# Altium project 24E_Ergo.PrjPcb
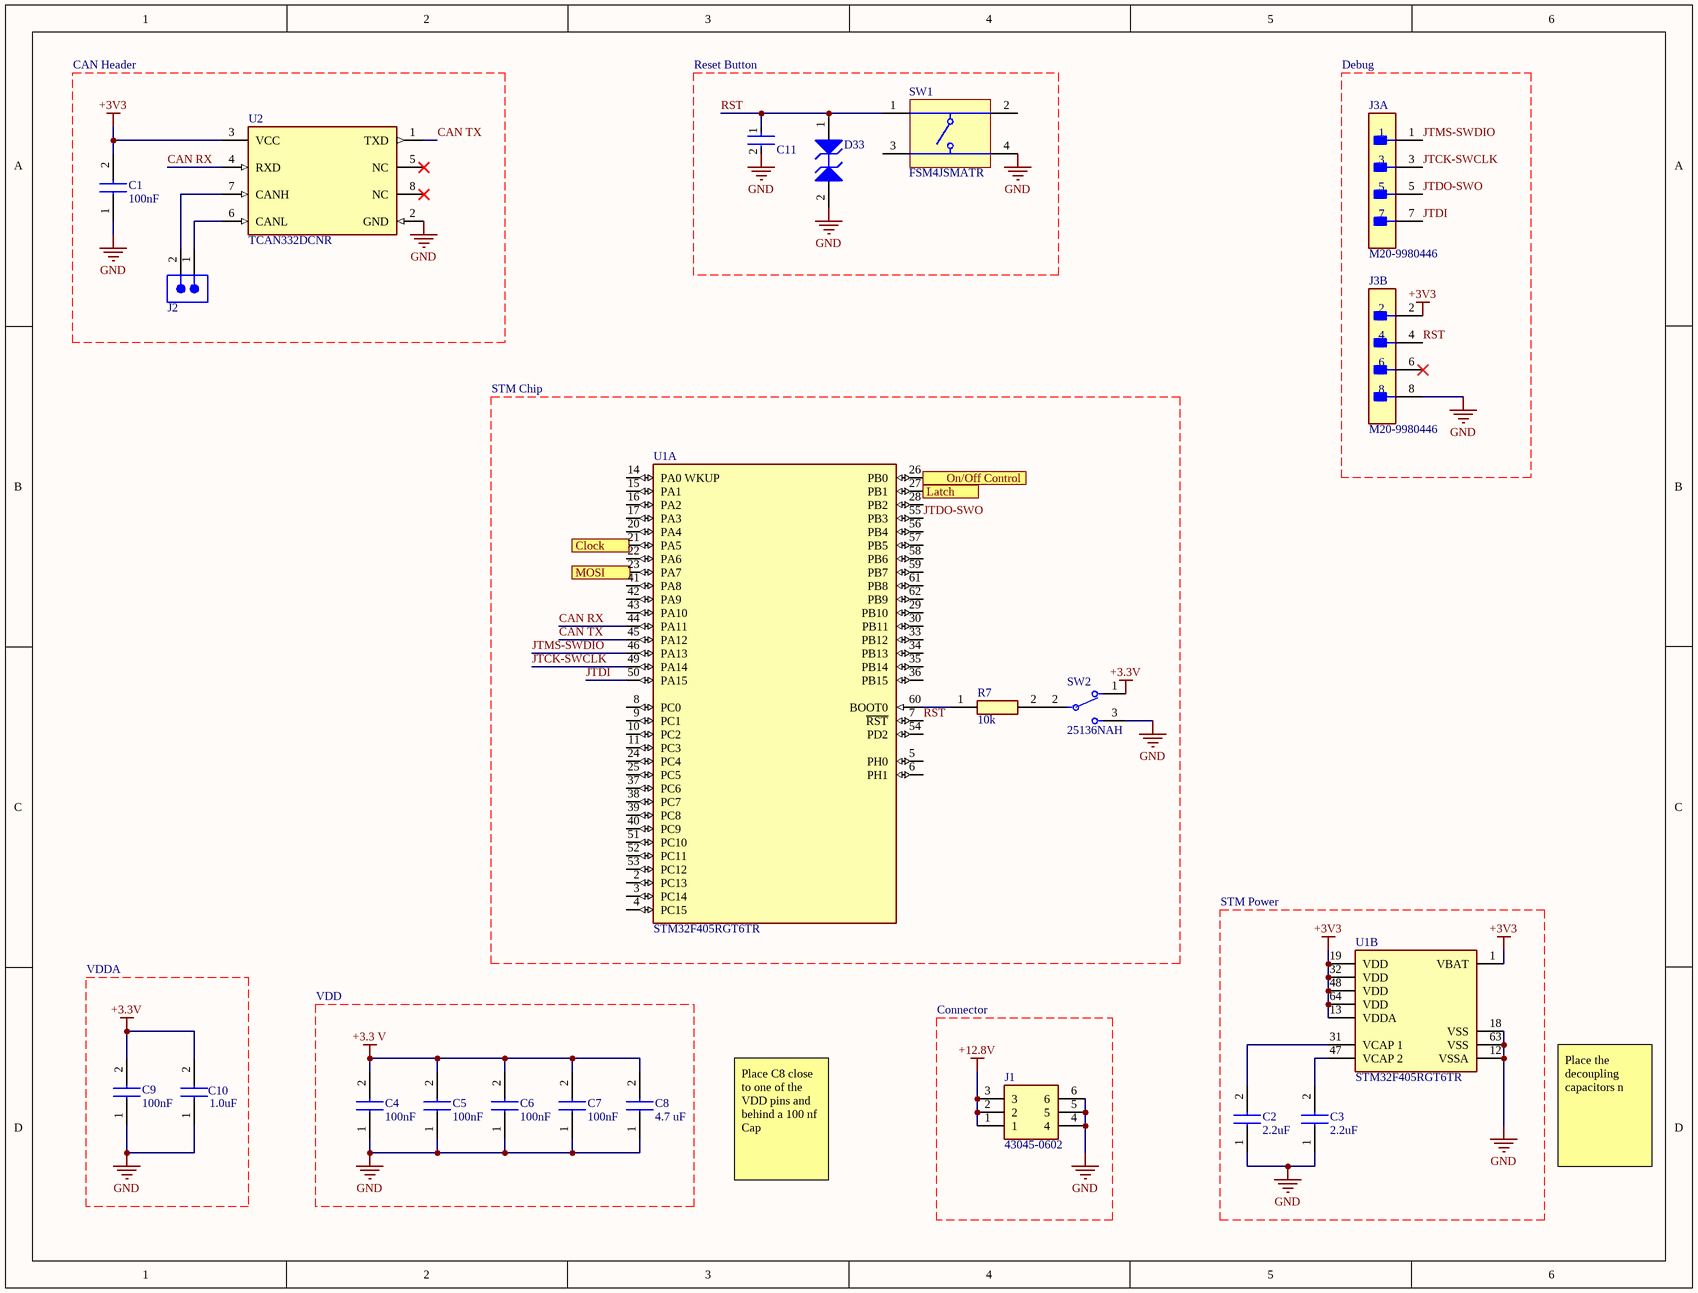
[diagram p0: STM32F405.SchDoc]
3 sheets, 70 parts. Net scope: flat (ports and power ports of the same name join across sheets).
Board file: 24E_Ergo.PcbDoc
Sheets:
  STM32F405.SchDoc
  Power_Tree.SchDoc
  LED_Array.SchDoc

## Sheet STM32F405.SchDoc
size 317 x 241 mm

### Parts
C1  100nF  [C1206]
C2  2.2uF  [CAPC2012X145N]
C3  2.2uF  [CAPC2012X145N]
C4  100nF  [C1206]
C5  100nF  [C1206]
C6  100nF  [C1206]
C7  100nF  [C1206]
C8  4.7 uF  [C1210]
C9  100nF  [CAPC3216X95N]
C10  1.0uF  [C0805]
C11  100 nF  [FP-CL31-IPC_C]  (value not drawn)
D33  ESD5B5.0ST1G  [ONSC-SOD-523-2-502-01_C_V]  (value not drawn)
J1  43045-0602  [43045-06(00,01,02,10)]
J2  679302124022  [679302124022]  (value not drawn)
J3  M20-9980446  [FP-M20-9980446-MFG]  (parts A,B of 2)
R7  10k  [RESC3016X65N]
SW1  FSM4JSMATR  [TECO-FSM4JSMATR_V]
SW2  25136NAH  [FP-25136NAH-MFG]
U1  STM32F405RGT6TR  [FP-LQFP64-5W-IPC_C]  (parts A,B of 2)
U2  TCAN332DCNR  [FP-DCN0008A-IPC_A]

### Ports
Clock (out), Latch (out), MOSI (out), On/Off Control (out)

### Nets
+3.3 V: C4.2 C5.2 C6.2 C7.2 C8.2
+3.3V: C9.2 C10.2 SW2.1
+3V3: C1.2 J3.2 U1.1(VBAT) U1.13(VDDA) U1.19(VDD) U1.32(VDD) U1.48(VDD) U1.64(VDD) U2.3(VCC)
+12.8V: J1.1 J1.2 J1.3
GND: C1.1 C2.1 C3.1 C4.1 C5.1 C6.1 C7.1 C8.1 C9.1 C10.1 C11.2 D33.2(A2) J1.4 J1.5 J1.6 J3.8 SW1.4 SW2.3 U1.12(VSSA) U1.18(VSS) U1.63(VSS) U2.2(GND)
CAN RX: U1.44(PA11) U2.4(RXD)
CAN TX: U1.45(PA12) U2.1(TXD)
JTCK-SWCLK: J3.3 U1.49(PA14)
JTDI: J3.7 U1.50(PA15)
JTDO-SWO: J3.5 U1.55(PB3)
JTMS-SWDIO: J3.1 U1.46(PA13)
RST: C11.1 D33.1(A1) J3.4 SW1.1 U1.7(~{RST})
NetC2_2: C2.2 U1.31(VCAP_1)
NetC3_2: C3.2 U1.47(VCAP_2)
NetIC3_4: U1.27(PB1) ; port Latch
NetIC3_21: U1.26(PB0) ; port On/Off Control
NetJ2_1: J2.1 U2.6(CANL)
NetJ2_2: J2.2 U2.7(CANH)
NetR7_1: R7.1 U1.60(BOOT0)
NetR7_2: R7.2 SW2.2

Not connected (* = marked no-connect by the designer): J3 6*; SW1 2 3; U1 2(PC13) 3(PC14) 4(PC15) 5(PH0) 6(PH1) 8(PC0) 9(PC1) 10(PC2) 11(PC3) 14(PA0_WKUP) 15(PA1) 16(PA2) 17(PA3) 20(PA4) 21(PA5) 22(PA6) 23(PA7) 24(PC4) 25(PC5) 28(PB2) 29(PB10) 30(PB11) 33(PB12) 34(PB13) 35(PB14) 36(PB15) 37(PC6) 38(PC7) 39(PC8) 40(PC9) 41(PA8) 42(PA9) 43(PA10) 51(PC10) 52(PC11) 53(PC12) 54(PD2) 56(PB4) 57(PB5) 58(PB6) 59(PB7) 61(PB8) 62(PB9); U2 5(NC)* 8(NC)*

### Notes on the sheet
- CAN Header
- Reset Button
- Debug
- STM Chip
- STM Power
- VDDA
- VDD
- Connector
- Place C8 close to one of the VDD pins and behind a 100 nf Cap
- Place the decoupling capacitors n

### Library data of the parts
C1 C4-C7 = C1206C104K5RACTU: Capacitor; Manufacturer_Name: KEMET; Datasheet Link: https://content.kemet.com/datasheets/KEM_C1002_X7R_SMD.pdf; Manufacturer_Part_Number: C1206C104K5RACTU; Mouser Part Number: 80-C1206C104K5R; Mouser Price/Stock: https://www.mouser.co.uk/ProductDetail/KEMET/C1206C104K5RACTU?qs=VbFpUC1cecnmBMAUeCQCPw%3D%3D; Arrow Part Number: C1206C104K5RACTU; Arrow Price/Stock: https://www.arrow.com/en/products/c1206c104k5ractu/kemet-corporation?region=nac
C2 C3 = C2012X5R1V225K125AB: Capacitor; Manufacturer_Name: TDK; Datasheet Link: https://product.tdk.com/info/en/catalog/datasheets/mlcc_commercial_midvoltage_en.pdf; Height: 1.45mm; Manufacturer_Part_Number: C2012X5R1V225K125AB; Mouser Part Number: 810-C2012X5R1V225KAB; Mouser Price/Stock: https://www.mouser.co.uk/ProductDetail/TDK/C2012X5R1V225K125AB?qs=6JAMGB%252BEdkx9Qe2qZwx06Q%3D%3D; Arrow Part Number: C2012X5R1V225K125AB; Arrow Price/Stock: https://www.arrow.com/en/products/c2012x5r1v225k125ab/tdk
C8 = C1210C475K8RACTU: Capacitor; Manufacturer_Name: KEMET; Datasheet Link: https://content.kemet.com/datasheets/KEM_C1002_X7R_SMD.pdf; Manufacturer_Part_Number: C1210C475K8RACTU; Mouser Part Number: 80-C1210C475K8R; Mouser Price/Stock: https://www.mouser.co.uk/ProductDetail/KEMET/C1210C475K8RACTU?qs=oz8GmW2iRsteX%252BuxrlEukQ%3D%3D
C9 = CC1206KRX7R8BB104: Capacitor; Manufacturer_Name: YAGEO; Datasheet Link: https://4donline.ihs.com/images/VipMasterIC/IC/YAGO/YAGO-S-A0011723860/YAGO-S-A0011723860-1.pdf?hkey=6D3A4C79FDBF58556ACFDE234799DDF0; Height: 0.95mm; Manufacturer_Part_Number: CC1206KRX7R8BB104; Mouser Part Number: 603-CC206KRX7R8BB104; Mouser Price/Stock: https://www.mouser.co.uk/ProductDetail/YAGEO/CC1206KRX7R8BB104?qs=AgBp2OyFlx%2Fzdk9Exx7Hmw%3D%3D; Arrow Part Number: CC1206KRX7R8BB104; Arrow Price/Stock: https://www.arrow.com/en/products/cc1206krx7r8bb104/yageo?region=nac
C10 = C0805X105K3RACTU: Capacitor; Manufacturer_Name: KEMET; Datasheet Link: https://content.kemet.com/datasheets/KEM_C1013_X7R_FT-CAP_SMD.pdf; Height: 1.1mm; Manufacturer_Part_Number: C0805X105K3RACTU; Mouser Part Number: 80-C0805X105K3RACTU; Mouser Price/Stock: https://www.mouser.co.uk/ProductDetail/KEMET/C0805X105K3RACTU?qs=8Lo7A5hKj2SKGRiy4muzQg%3D%3D; Arrow Part Number: C0805X105K3RACTU; Arrow Price/Stock: https://www.arrow.com/en/products/c0805x105k3ractu/kemet-corporation?region=nac
C11 = CMP-13271-001835-1: Cap Ceramic 100nF 50V X7R ±10% SMD 1206 +125°C Embossed T/R; Capacitance: 100nF; Case Code (Metric): 3216; Case/Package: 1206; Ratings: AEC-Q200; Mount: Surface Mount; Tolerance: 10%; Voltage Rating: 50V; Packaging: Tape and Reel; Max Operating Temperature: 125°C; Min Operating Temperature: -55°C; Case Code (Imperial): 1206; Dielectric: X7R
D33 = CMP-1063-00096-1: Transient Voltage Suppressor, Micro-Packaged Diode for ESD Protection, 2-Pin SOD-523, Pb-Free, Tape and Reel; Manufacturer: On Semiconductor; Number of Lines: 1; Direction: Bidirectional; VRWM Max (V): 5; V(BR) Min (V): 5.8; ComponentLink2URL: http://www.onsemi.cn/pub_link/Collateral/ESD5B5.0ST1G.PDF; Mounting Technology: Surface Mount; ComponentLink1URL: http://www.onsemi.com/; ComponentLink2Description: Datasheet; ComponentLink3Description: Package Specification; RoHS: Pb-Free; Packing: Tape and Reel; PackageDescription: 2-Pin SOD, Body 1.2 x 0.8 mm; ComponentLink1Description: Manufacturer URL; ComponentLink3URL: http://www.onsemi.cn/pub_link/Collateral/ESD5B5.0ST1G.PDF; PackageVersion: Rev. C, 03/2007; DatasheetVersion: Rev. 3; PartNumber: ESD5B5.0ST1G; PackageReference: SOD-523-2-502-01_C; IR Max (uA): 1
J1 = 43045-0602: Connector; Manufacturer_Name: Molex; Datasheet Link: https://www.molex.com/pdm_docs/sd/430450200_sd.pdf; Height: 9.9mm; Manufacturer_Part_Number: 43045-0602; Mouser Part Number: 538-43045-0602; Mouser Price/Stock: https://www.mouser.co.uk/ProductDetail/Molex/43045-0602?qs=mrPiglD9aYLv9OehwOZTng%3D%3D
J2 = CMP-1502-00721-2: NexarPartId: 18818281; Number of Positions: 2; Connector Type: Male Pin; Contact Resistance: 20mΩ; Operating Supply Voltage: 50V; Insulation: Insulated; Gender: Male; Pitch: 1.5mm; Insulation Resistance: 100MΩ; Current Rating: 1A; Flammability Rating: UL94 V-0; Contact Gender: Male; Orientation: Vertical; Color: Beige, White; Termination: SMD/SMT; Length: 6mm; Width: 6mm; Packaging: Tape and Reel; Contact Material: Copper; Contact Plating: Tin; Mount: Surface Mount; Max Operating Temperature: 85°C; Number of Pins: 2; Voltage Rating: 50V; Housing Material: Nylon; Number of Contacts: 2; Number of Rows: 1; Height: 5mm; Lead Pitch: 1.5mm; REACH SVHC: Unknown; RoHS: Compliant; Min Operating Temperature: -25°C
J3 = CMP-15831-000088-1: CONN HEADER VERT 8POS 2.54MM; Row Spacing: 0.1inch; Current Rating: 3A; Mated Stacking Heights: 16.54mm; Insulation Resistance: 10GR; Connector Type: Male Pin; Gender: Male; Number of Contacts: 8; Contact Resistance: 30mR; Contact Material: Brass; Series: M20; Max Operating Temperature: 105°C; REACH SVHC: No SVHC; Flammability Rating: UL94 V-0; Number of Rows: 2; Mount: Through Hole; Contact Plating: Tin; Min Operating Temperature: -40°C; Packaging: Bulk; Radiation Hardening: No; Insulation Material: Nylon; Orientation: Straight; Contact Shape: Square; Max Current Rating: 3A; Contact Type: Male Pin; Depth: 5.08mm; Color: Black; Contact Finish - Mating: TIN; Length: 10.16mm; Housing Color: Black; Package Quantity: 1000; Pitch: 2.54mm; Contact Mating Length: 0.24inch; Termination: Solder; Housing Material: Nylon; Fastening Type: Pull; Insulation Color: Black; Number of Positions: 8; RoHS Compliant: Yes
R7 = RP73D2B10KBTDF: Resistor; Manufacturer_Name: TE Connectivity; Datasheet Link: https://www.te.com/commerce/DocumentDelivery/DDEController?Action=srchrtrv&DocNm=8-1773459-4_ELEVATOR_ESCALATOR_SOLUTIONS&DocType=Data%20Sheet&DocLang=English&PartCntxt=6-1879261-8&DocFormat=pdf; Height: 0.65mm; Manufacturer_Part_Number: RP73D2B10KBTDF; Mouser Part Number: 279-RP73D2B10KBTDF; Mouser Price/Stock: https://www.mouser.co.uk/ProductDetail/TE-Connectivity-Holsworthy/RP73D2B10KBTDF?qs=8G8kQhBkhGisIrE0IZvSPA%3D%3D; Arrow Part Number: RP73D2B10KBTDF; Arrow Price/Stock: https://www.arrow.com/en/products/rp73d2b10kbtdf/te-connectivity?region=nac
SW1 = CMP-2000-07486-1: Micro Miniature Push Button Switch FSM JSM, 50 mA, -35 to 85 degC, 4-Pin SMD, RoHS, Tape and Reel; Manufacturer: TE Connectivity; Mechanical Life: 100000Cycles; Current Rating: 50mA; Actuator Material: Polyamide; Max Voltage Rating (DC): 12V; Capacitance: 0f; Illumination Type: Illuminated; Voltage Rating (DC): 24V; Case\/Package: SMD/SMT; Operating Force: 160gf; Contact Resistance: 100mOhm; Actuator Length: 0.055inch; Switch Travel: 0.25mm; Throw Configuration: SPST; Termination: GullWing; Contact Plating: Silver; Orientation: Straight; Mounting Technology: SurfaceMount; REACH SVHC: Unknown; Electrical Life: 100000Cycles; Package Reference: FSM4JSMATR; Max Operating Temperature: 85degC; Manufacturer URL: http://www.te.com/; Package Description: 4-Pin Surface Mount Device, Body 6 x 6 mm, Pitch 4.5 mm; Datasheet Version: Rev. V, 02/2015; Packaging: TapeandReel; Min Operating Temperature: -35degC; Mount: SurfaceMount; Contact Current Rating: 50mA; Contact Material: CopperAlloy; Package Quantity: 1200; Datasheet URL: http://www.te.com/commerce/DocumentDelivery/DDEController?Action=showdoc&DocId=Customer+Drawing%7F2-1437565-7%7FV%7Fpdf%7FEnglish%7FENG_CD_2-1437565-7_V.pdf%7F4-1437565-2; RoHSCompliant: true
SW2 = CMP-47022-000001-1: SWITCH SLIDE SPDT 4A 125V; Actuator Material: Nylon; Max Current Rating: 1A; Electrical Life: 10000Cycles; Mechanical Life: 20000Cycles; Actuator Length: 2.8mm; Switch Function: On-On; Switch Travel: 4mm; Illumination Type: Non-Illuminated; Max Voltage Rating (AC): 250V; Insulation Resistance: 1GR; Actuator Type: Standard; Max Voltage Rating (DC): 30V; Contact Resistance: 10mR; Contact Plating: Silver; Mount: Through Hole; Voltage Rating (AC): 125V; Min Operating Temperature: -40°C; Contact Current Rating: 4A; Orientation: Vertical; Termination: PC Pins; Current Rating: 1A; Depth: 7.5mm; Max Operating Temperature: 85°C; Package Quantity: 100; Throw Configuration: SPDT; Contact Material: Silver; REACH SVHC: No SVHC; Packaging: Bulk; Voltage Rating (DC): 30V; Length: 14.1mm
U1 = CMP-0243-00156-2: IC MCU 32BIT 1MB FLASH 64LQFP; Frequency: 168MHz; Number of SPI Channels: 3; Oscillator Type: Internal; Core Architecture: ARM; Number of UART Channels: 2; Max Supply Voltage: 3.6V; Watchdog Timer: Yes; RAM Size: 196KB; Interface: I2C; Max Power Dissipation: 435mW; Number of Timers/Counters: 14; Data Bus Width: 32b; Peripherals: Brown-out Detect/Reset; Number of ADC Channels: 16; Min Supply Voltage: 1.8V; Number of Programmable I/O: 51; Memory Size: 1024KB; Max Operating Temperature: 85°C; Package Quantity: 1000; Lead Free: Lead Free; Memory Type: FLASH; Case/Package: LQFP; Number of I2C Channels: 3; Contact Plating: Tin; Mount: Surface Mount; Min Operating Temperature: -40°C; Radiation Hardening: No; Number of USB Channels: 2; Packaging: Tape and Reel; Height: 1.45mm; Number of Pins: 64; Number of I/Os: 51; Max Frequency: 168MHz; Width: 10mm; Length: 10mm
U2 = CMP-04872-000203-1: IC TRANSCEIVER 1/1 SOT23-8; Receiver Hysteresis: 120mV; Packaging: Tape and Reel; Mount: Surface Mount; RoHS Compliant: Yes; Min Operating Temperature: -40°C; Case/Package: SOT-23-8; Lead Free: Lead Free; Max Operating Temperature: 125°C

## Sheet Power_Tree.SchDoc
size A
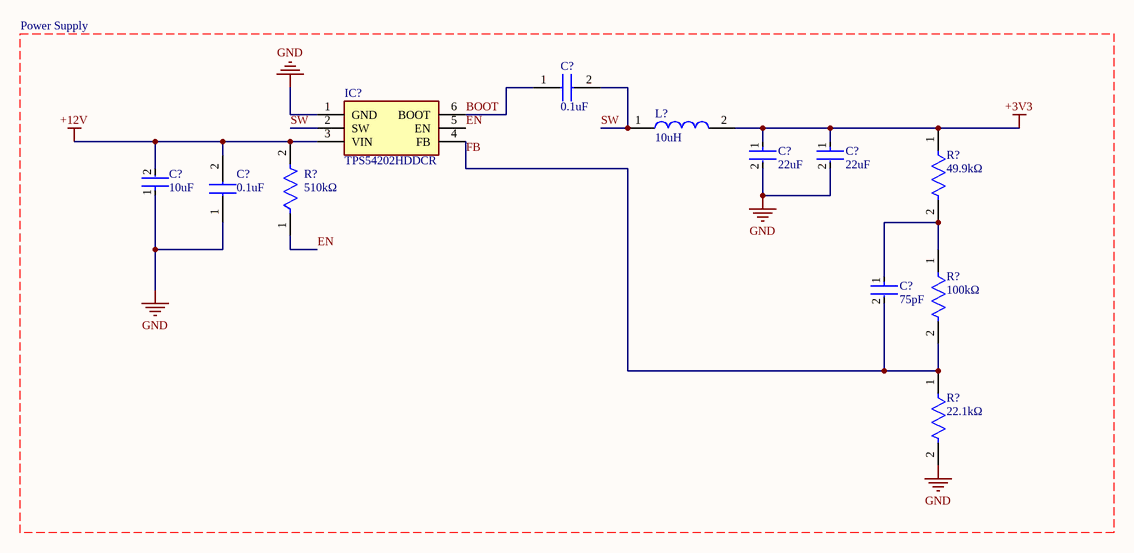
[diagram p1: Power_Tree.SchDoc]

### Parts
(Parts that share a designator on the sheet are numbered #1, #2 ... from top to bottom, then left to right.)
C?#1  0.1uF  [C0805]
C?#2  22uF  [FP-1206-L_3_2_0_3-W_1_6_0-IPC_A]
C?#3  22uF  [FP-1206-L_3_2_0_3-W_1_6_0-IPC_A]
C?#4  10uF  [FP-GRT31C-0_2-IPC_A]
C?#5  0.1uF  [C0805]
C?#6  75pF  [FP-C1206C-EB-MFG]
IC?  TPS54202HDDCR  [SOT95P280X110-6N]
L?  10uH  [SRN6045_1]
R?#1  49.9kΩ  [FP-CRCW0805-e3-IPC_C]
R?#2  510kΩ  [FP-CRCW0805-e3-IPC_B]
R?#3  100kΩ  [FP-CRCW0805-e3-MFG]
R?#4  22.1kΩ  [FP-CRCW0805-e3-IPC_C]

### Nets
+3V3: C?#2.1 C?#3.1 L?.2 R?#1.1
+12V: C?#4.2 C?#5.2 IC?.3(VIN) R?#2.2
GND: C?#2.2 C?#3.2 C?#4.1 C?#5.1 IC?.1(GND) R?#4.2
BOOT: C?#1.1 IC?.6(BOOT)
EN: IC?.5(EN) R?#2.1
FB: C?#6.2 IC?.4(FB) R?#3.2 R?#4.1
SW: C?#1.2 IC?.2(SW) L?.1
NetC?#6_1: C?#6.1 R?#1.2 R?#3.1

### Notes on the sheet
- Power Supply

### Library data of the parts
C?#1 C?#5 = C0805C104K6RACTU: Capacitor; Manufacturer_Name: KEMET; Datasheet Link: https://content.kemet.com/datasheets/KEM_C1002_X7R_SMD.pdf; Height: 1.1mm; Manufacturer_Part_Number: C0805C104K6RACTU; Mouser Part Number: 80-C0805C104K6R; Mouser Price/Stock: https://www.mouser.co.uk/ProductDetail/KEMET/C0805C104K6RACTU?qs=NrXEK%2Fuukt5je6JkV2NA6Q%3D%3D; Arrow Part Number: C0805C104K6RACTU; Arrow Price/Stock: https://www.arrow.com/en/products/c0805c104k6ractu/kemet-corporation?region=nac
C?#2 C?#3 = CMP-14477-000099-2: None; Tolerance: 20%; Voltage Rating: 16V; Dielectric: X7R; Lead Free: Lead Free; Min Operating Temperature: -55°C; Max Operating Temperature: 125°C; Case/Package: 1206; RoHS Compliant: Yes; Case Code (Metric): 3216; Width: 0.063inch; Case Code (Imperial): 1206; Thickness: 0.071inch; Capacitance: 22uF; Packaging: Tape and Reel; Length: 0.126inch; Mount: Surface Mount
C?#4 = CMP-06035-000076-2: Multi-Layer Ceramic Capacitor 10uF 50V X5R ±10% 1206 Emboss T/R; Length: 0.126inch; Max Operating Temperature: 85°C; Width: 0.063inch; Ratings: AEC-Q200; Voltage Rating: 50V; Dielectric: X5R; Min Operating Temperature: -55°C; Case Code (Imperial): 1206; Capacitance: 10uF; Case Code (Metric): 3216; Thickness: 0.071inch; Tolerance: 10%; Mount: Surface Mount; Case/Package: 1206; Packaging: Cut Tape; Voltage Rating (DC): 50V
C?#6 = CMP-1037-01478-2: CAP CER 75PF 50V NP0 1206; Manufacturer Part Number: C1206C750J5GACTU; Manufacturer: KEMET; Temperature Coefficient: 15%; Tolerance: 0.05; Automotive Grade: Grade 0; Temperature Characteristic: C0G; Material: Ceramic; Mouser Description: Cap Ceramic 75pF 50V C0G 5% SMD 1206 125°C Plastic T/R; Package: C1206C-EB; Device Class L1: Passive Components; Lead Free: Yes; Digikey Description: CAP CER 75PF 50V NP0 1206; Capacitance: 75 pF; Automotive: Yes; Height: 0.88mm; Value: 75 pF; ComponentLink2Description: Datasheet; Temperature Range High: +150°C; Temperature: -55°C to +150°C; Temperature Range Low: -55°C; Device Class L3: Ceramic Capacitors; Octopart: https://octopart.com/c1206c750j5gactu-kemet-9139197; Device Class L2: Capacitors; RoHS: TRUE; Category: Cap; Voltage Rating: 50 V; ComponentLink2URL: https://content.kemet.com/datasheets/KEM_C1007_X8R_ULTRA_150C_SMD.pdf; Ipc Land Pattern Name: CAPC320160X78
IC? = TPS54202HDDCR: Integrated Circuit; Manufacturer_Name: Texas Instruments; Datasheet Link: http://www.ti.com/lit/gpn/tps54202h; Height: 1.1mm; Manufacturer_Part_Number: TPS54202HDDCR; Mouser Part Number: 595-TPS54202HDDCR; Mouser Price/Stock: https://www.mouser.co.uk/ProductDetail/Texas-Instruments/TPS54202HDDCR?qs=uP22XH7NdCtzy%252BOdxI8qhQ%3D%3D; Arrow Part Number: TPS54202HDDCR; Arrow Price/Stock: https://www.arrow.com/en/products/tps54202hddcr/texas-instruments?region=nac
L? = SRN6045-100M: Inductor; Manufacturer_Name: Bourns; Datasheet Link: https://componentsearchengine.com/Datasheets/2/SRN6045-100M.pdf; Manufacturer_Part_Number: SRN6045-100M; Mouser Part Number: 652-SRN6045-100M; Mouser Price/Stock: https://www.mouser.co.uk/ProductDetail/Bourns/SRN6045-100M?qs=opBjA1TV900pBUPQKVevSA%3D%3D; Arrow Part Number: SRN6045-100M; Arrow Price/Stock: https://www.arrow.com/en/products/srn6045-100m/bourns?region=nac
R?#1 = CMP-2001-03952-2: RES Thick Film, 49.9kΩ, 1%, 0.125W, 100ppm/°C, 0805; Resistance: 49.9kR; Power Rating: 125mW; Voltage Rating (DC): 150V; Contact Plating: Tin; Case Code (Imperial): 0805; Package Quantity: 10; Termination: SMD/SMT; Length: 2mm; Width: 0.049inch; Case Code (Metric): 2012; Temperature Coefficient: 100ppm/°C; Tolerance: 1%; Depth: 1.25mm; Mount: Surface Mount; Lead Free: Lead Free; Min Operating Temperature: -55°C; Case/Package: 0805; Number of Terminations: 2; Composition: Thick Film; Height: 0.45mm; Voltage Rating: 150V; Max Power Dissipation: 125mW; Features: Automotive AEC-Q200; Military Standard: Not; Radiation Hardening: No; Max Operating Temperature: 155°C; Weight: 0.000194oz; Packaging: Tape and Reel
R?#2 = CMP-2001-03987-2: RES Thick Film, 510kΩ, 1%, 0.125W, 100ppm/°C, 0805; Power Rating: 125mW; Voltage Rating (DC): 150V; Resistance: 510kR; Length: 2mm; Min Operating Temperature: -55°C; Package Quantity: 10; Tolerance: 1%; Width: 1.25mm; Contact Plating: Tin; Mount: Surface Mount; Voltage Rating: 150V; Temperature Coefficient: 100ppm/°C; Radiation Hardening: No; Case/Package: 0805; Max Power Dissipation: 125mW; Military Standard: Not; Case Code (Imperial): 0805; Lead Free: Lead Free; Height: 0.45mm; Termination: SMD/SMT; Packaging: Tape and Reel; Depth: 1.25mm; Features: Automotive AEC-Q200; Weight: 0.000194oz; Max Operating Temperature: 155°C; Composition: Thick Film; Case Code (Metric): 2012; Number of Pins: 2; Number of Terminations: 2
R?#3 = CMP-2001-04899-2: RES Thick Film, 100kΩ, 1%, 0.125W, 100ppm/°C, 0805; Resistance: 100kR; Power Rating: 125mW; Voltage Rating: 150V; Case/Package: 0805; Max Operating Temperature: 155°C; Case Code (Imperial): 0805; Lead Free: Lead Free; Weight: 0.000194oz; Number of Pins: 2; Package Quantity: 5000; Height: 0.45mm; Composition: Thick Film; Military Standard: Not; Tolerance: 1%; Case Code (Metric): 2012; Termination: SMD/SMT; Mount: Surface Mount; Radiation Hardening: No; Width: 1.25mm; Length: 2mm; Depth: 1.25mm; Packaging: Tape and Reel; Min Operating Temperature: -55°C; Contact Plating: Tin; Temperature Coefficient: 100ppm/°C; Voltage Rating (DC): 150V
R?#4 = CMP-2001-03689-2: RES Thick Film, 22.1kΩ, 1%, 0.125W, 100ppm/°C, 0805; Voltage Rating (DC): 150V; Max Power Dissipation: 125mW; Resistance: 22.1kR; Voltage Rating: 150V; Height: 0.45mm; Packaging: Tape and Reel; Lead Free: Lead Free; Composition: Thick Film; Temperature Coefficient: 100ppm/°C; Depth: 1.25mm; Length: 2mm; Case Code (Metric): 2012; Number of Terminations: 2; Case/Package: 0805; Termination: SMD/SMT; Power Rating: 125mW; Package Quantity: 10; Max Operating Temperature: 155°C; Radiation Hardening: No; Width: 1.25mm; Military Standard: Not; Weight: 0.000194oz; Contact Plating: Tin; Min Operating Temperature: -55°C; Features: Automotive AEC-Q200; Case Code (Imperial): 0805; Tolerance: 1%

## Sheet LED_Array.SchDoc
size 508 x 241 mm
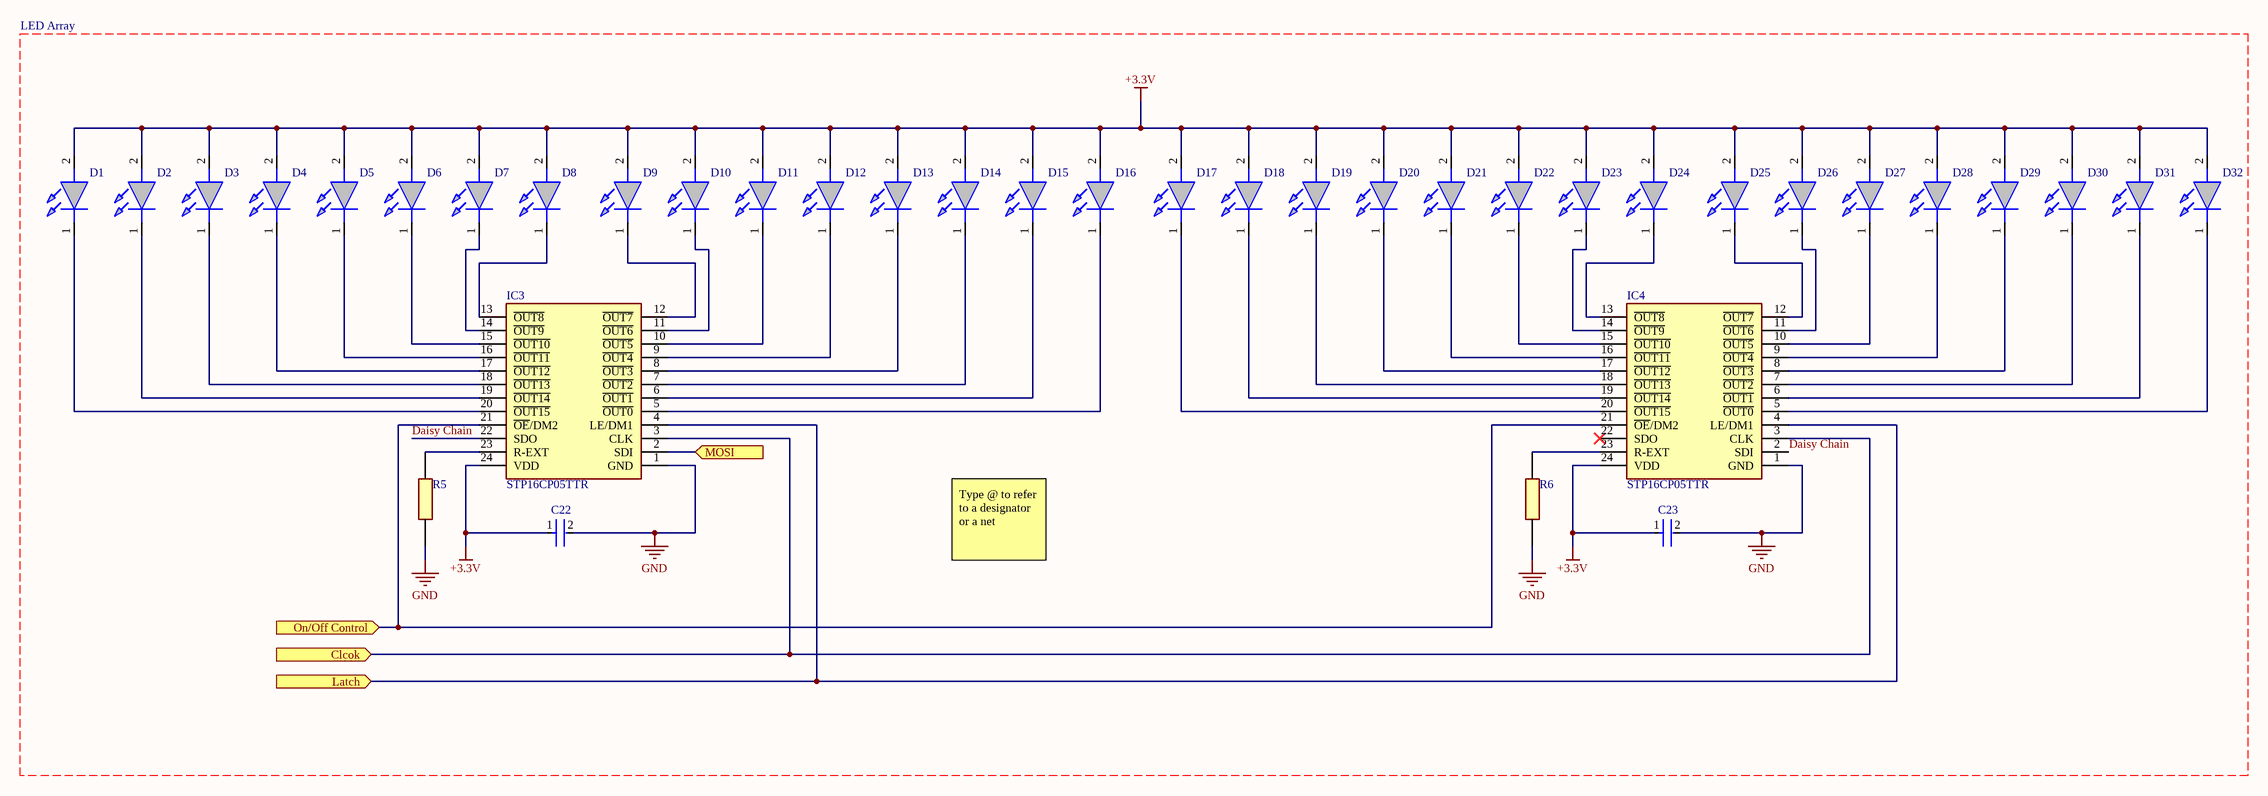
[diagram p2: LED_Array.SchDoc]

### Parts
C22  CL31B104KBP5PNF  [FP-CL31-IPC_C]  (value not drawn)
C23  CL31B104KBP5PNF  [FP-CL31-IPC_C]  (value not drawn)
D1  LR_T64F-BBDB-1-1  [LEDM3528X380N]  (value not drawn)
D2  LR_T64F-BBDB-1-1  [LEDM3528X380N]  (value not drawn)
D3  LR_T64F-BBDB-1-1  [LEDM3528X380N]  (value not drawn)
D4  LR_T64F-BBDB-1-1  [LEDM3528X380N]  (value not drawn)
D5  LR_T64F-BBDB-1-1  [LEDM3528X380N]  (value not drawn)
D6  LR_T64F-BBDB-1-1  [LEDM3528X380N]  (value not drawn)
D7  LR_T64F-BBDB-1-1  [LEDM3528X380N]  (value not drawn)
D8  LR_T64F-BBDB-1-1  [LEDM3528X380N]  (value not drawn)
D9  LR_T64F-BBDB-1-1  [LEDM3528X380N]  (value not drawn)
D10  LR_T64F-BBDB-1-1  [LEDM3528X380N]  (value not drawn)
D11  LR_T64F-BBDB-1-1  [LEDM3528X380N]  (value not drawn)
D12  LR_T64F-BBDB-1-1  [LEDM3528X380N]  (value not drawn)
D13  LR_T64F-BBDB-1-1  [LEDM3528X380N]  (value not drawn)
D14  LR_T64F-BBDB-1-1  [LEDM3528X380N]  (value not drawn)
D15  LR_T64F-BBDB-1-1  [LEDM3528X380N]  (value not drawn)
D16  LR_T64F-BBDB-1-1  [LEDM3528X380N]  (value not drawn)
D17  LR_T64F-BBDB-1-1  [LEDM3528X380N]  (value not drawn)
D18  LR_T64F-BBDB-1-1  [LEDM3528X380N]  (value not drawn)
D19  LR_T64F-BBDB-1-1  [LEDM3528X380N]  (value not drawn)
D20  LR_T64F-BBDB-1-1  [LEDM3528X380N]  (value not drawn)
D21  LR_T64F-BBDB-1-1  [LEDM3528X380N]  (value not drawn)
D22  LR_T64F-BBDB-1-1  [LEDM3528X380N]  (value not drawn)
D23  LR_T64F-BBDB-1-1  [LEDM3528X380N]  (value not drawn)
D24  LR_T64F-BBDB-1-1  [LEDM3528X380N]  (value not drawn)
D25  LR_T64F-BBDB-1-1  [LEDM3528X380N]  (value not drawn)
D26  LR_T64F-BBDB-1-1  [LEDM3528X380N]  (value not drawn)
D27  LR_T64F-BBDB-1-1  [LEDM3528X380N]  (value not drawn)
D28  LR_T64F-BBDB-1-1  [LEDM3528X380N]  (value not drawn)
D29  LR_T64F-BBDB-1-1  [LEDM3528X380N]  (value not drawn)
D30  LR_T64F-BBDB-1-1  [LEDM3528X380N]  (value not drawn)
D31  LR_T64F-BBDB-1-1  [LEDM3528X380N]  (value not drawn)
D32  LR_T64F-BBDB-1-1  [LEDM3528X380N]  (value not drawn)
IC3  STP16CP05TTR  [SOP65P638X110-24N]
IC4  STP16CP05TTR  [SOP65P638X110-24N]
R5  ERA-8APB122V  [RESC3216X70N]  (value not drawn)
R6  ERA-8APB122V  [RESC3216X70N]  (value not drawn)

### Ports
Clcok (in), Latch (in), MOSI (in), On/Off Control (in)

### Nets
+3.3V: C22.1 C23.1 D1.2(A) D2.2(A) D3.2(A) D4.2(A) D5.2(A) D6.2(A) D7.2(A) D8.2(A) D9.2(A) D10.2(A) D11.2(A) D12.2(A) D13.2(A) D14.2(A) D15.2(A) D16.2(A) D17.2(A) D18.2(A) D19.2(A) D20.2(A) D21.2(A) D22.2(A) D23.2(A) D24.2(A) D25.2(A) D26.2(A) D27.2(A) D28.2(A) D29.2(A) D30.2(A) D31.2(A) D32.2(A) IC3.24(VDD) IC4.24(VDD)
GND: C22.2 C23.2 IC3.1(GND) IC4.1(GND) R5.1 R6.1
Daisy Chain: IC3.22(SDO) IC4.2(SDI)
NetD1_1: D1.1(K) IC3.20(~{OUT15})
NetD2_1: D2.1(K) IC3.19(~{OUT14})
NetD3_1: D3.1(K) IC3.18(~{OUT13})
NetD4_1: D4.1(K) IC3.17(~{OUT12})
NetD5_1: D5.1(K) IC3.16(~{OUT11})
NetD6_1: D6.1(K) IC3.15(~{OUT10})
NetD7_1: D7.1(K) IC3.14(~{OUT9})
NetD8_1: D8.1(K) IC3.13(~{OUT8})
NetD9_1: D9.1(K) IC3.12(~{OUT7})
NetD10_1: D10.1(K) IC3.11(~{OUT6})
NetD11_1: D11.1(K) IC3.10(~{OUT5})
NetD12_1: D12.1(K) IC3.9(~{OUT4})
NetD13_1: D13.1(K) IC3.8(~{OUT3})
NetD14_1: D14.1(K) IC3.7(~{OUT2})
NetD15_1: D15.1(K) IC3.6(~{OUT1})
NetD16_1: D16.1(K) IC3.5(~{OUT0})
NetD17_1: D17.1(K) IC4.20(~{OUT15})
NetD18_1: D18.1(K) IC4.19(~{OUT14})
NetD19_1: D19.1(K) IC4.18(~{OUT13})
NetD20_1: D20.1(K) IC4.17(~{OUT12})
NetD21_1: D21.1(K) IC4.16(~{OUT11})
NetD22_1: D22.1(K) IC4.15(~{OUT10})
NetD23_1: D23.1(K) IC4.14(~{OUT9})
NetD24_1: D24.1(K) IC4.13(~{OUT8})
NetD25_1: D25.1(K) IC4.12(~{OUT7})
NetD26_1: D26.1(K) IC4.11(~{OUT6})
NetD27_1: D27.1(K) IC4.10(~{OUT5})
NetD28_1: D28.1(K) IC4.9(~{OUT4})
NetD29_1: D29.1(K) IC4.8(~{OUT3})
NetD30_1: D30.1(K) IC4.7(~{OUT2})
NetD31_1: D31.1(K) IC4.6(~{OUT1})
NetD32_1: D32.1(K) IC4.5(~{OUT0})
NetIC3_2: IC3.2(SDI) ; port MOSI
NetIC3_3: IC3.3(CLK) IC4.3(CLK) ; port Clcok
NetIC3_4: IC3.4(LE/DM1) IC4.4(LE/DM1) ; port Latch
NetIC3_21: IC3.21(~{OE}/DM2) IC4.21(~{OE}/DM2) ; port On/Off Control
NetIC3_23: IC3.23(R-EXT) R5.2
NetIC4_23: IC4.23(R-EXT) R6.2

Not connected (* = marked no-connect by the designer): IC4 22(SDO)*

### Notes on the sheet
- LED Array
- Type @ to refer to a designator or a net

### Library data of the parts
C22 C23 = CMP-13271-001835-1: as C11 on sheet STM32F405; Capacitance: 100nF; Case Code (Metric): 3216; Case/Package: 1206; Ratings: AEC-Q200; Mount: Surface Mount; Tolerance: 10%; Voltage Rating: 50V; Packaging: Tape and Reel; Max Operating Temperature: 125°C; Min Operating Temperature: -55°C; Case Code (Imperial): 1206; Dielectric: X7R
D1-D32 = LR_T64F-BBDB-1-1: Standard LEDs - SMD Red; Manufacturer_Name: ams OSRAM; Manufacturer_Part_Number: LR T64F-BBDB-1-1; Geometry.Height: 3.8mm; Mouser Part Number: 720-LRT64FBBDB11; Mouser Price/Stock: https://www.mouser.co.uk/ProductDetail/OSRAM-Opto-Semiconductors/LR-T64F-BBDB-1-1/?qs=bPsF1HUXLcPgtbSUB%252BvpOg%3D%3D; Datasheet Link: https://dammedia.osram.info/media/resource/hires/osram-dam-2493734/LR%20T64F.pdf
IC3 IC4 = STP16CP05TTR: STMICROELECTRONICS - STP16CP05TTR - IC LED SINK DRIVER, 16-BIT, LO V; Geometry.Height: 1.1mm; Mouser Part Number: 511-STP16CP05TTR; Mouser Price/Stock: https://www.mouser.co.uk/ProductDetail/STMicroelectronics/STP16CP05TTR?qs=%252BFmDY%2FmH7IYvcBEvWgB%2FVQ%3D%3D; Manufacturer_Name: STMicroelectronics; Manufacturer_Part_Number: STP16CP05TTR; Datasheet Link: http://www.st.com/web/en/resource/technical/document/datasheet/CD00126634.pdf
R5 R6 = ERA-8APB122V: Thin Film Resistors - SMD 1206 Thin film chip resistor; Manufacturer_Name: Panasonic; Geometry.Height: 0.7mm; Mouser Part Number: 667-ERA-8APB122V; Mouser Price/Stock: https://www.mouser.co.uk/ProductDetail/Panasonic/ERA-8APB122V?qs=PgLP5Altfoz8TeGz8FyJXw%3D%3D; Manufacturer_Part_Number: ERA-8APB122V; Datasheet Link: https://industrial.panasonic.com/cdbs/www-data/pdf/RDM0000/AOA0000C307.pdf

## Nets that join several sheets
+3.3V: STM32F405 (C9.2 C10.2 SW2.1), LED_Array (36 pins)
+3V3: STM32F405 (9 pins), Power_Tree (C?#2.1 C?#3.1 L?.2 R?#1.1)
GND: STM32F405 (22 pins), Power_Tree (6 pins), LED_Array (6 pins)
NetIC3_4: STM32F405 (U1.27), LED_Array (IC3.4 IC4.4)
NetIC3_21: STM32F405 (U1.26), LED_Array (IC3.21 IC4.21)